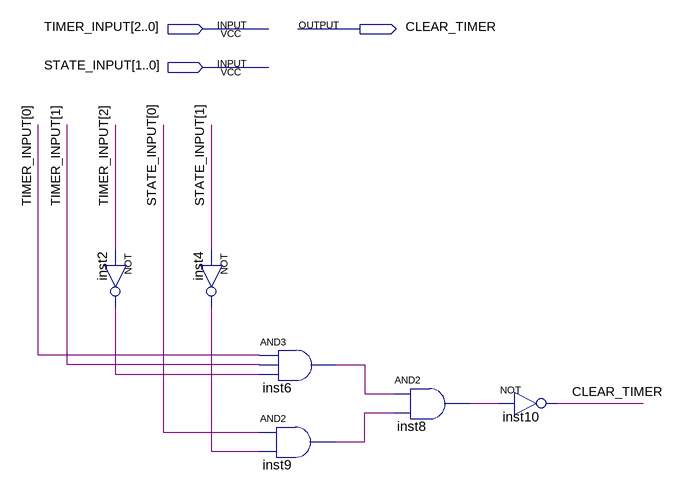
[diagram p0: schematic sheet]
// Quartus schematic TIMER_CONTROLLER.bdf as structural Verilog: 6 symbols, 3 pins
module TIMER_CONTROLLER (
  input  [2:0] TIMER_INPUT,
  input  [1:0] STATE_INPUT,
  output CLEAR_TIMER
);

  wire inst2_out, inst4_out, inst6_out, inst8_out, inst9_out;

  not inst2 (inst2_out, TIMER_INPUT[2]);
  not inst4 (inst4_out, STATE_INPUT[1]);
  and inst6 (inst6_out, TIMER_INPUT[0], TIMER_INPUT[1], inst2_out);
  and inst9 (inst9_out, STATE_INPUT[0], inst4_out);
  and inst8 (inst8_out, inst6_out, inst9_out);
  not inst10 (CLEAR_TIMER, inst8_out);
endmodule
